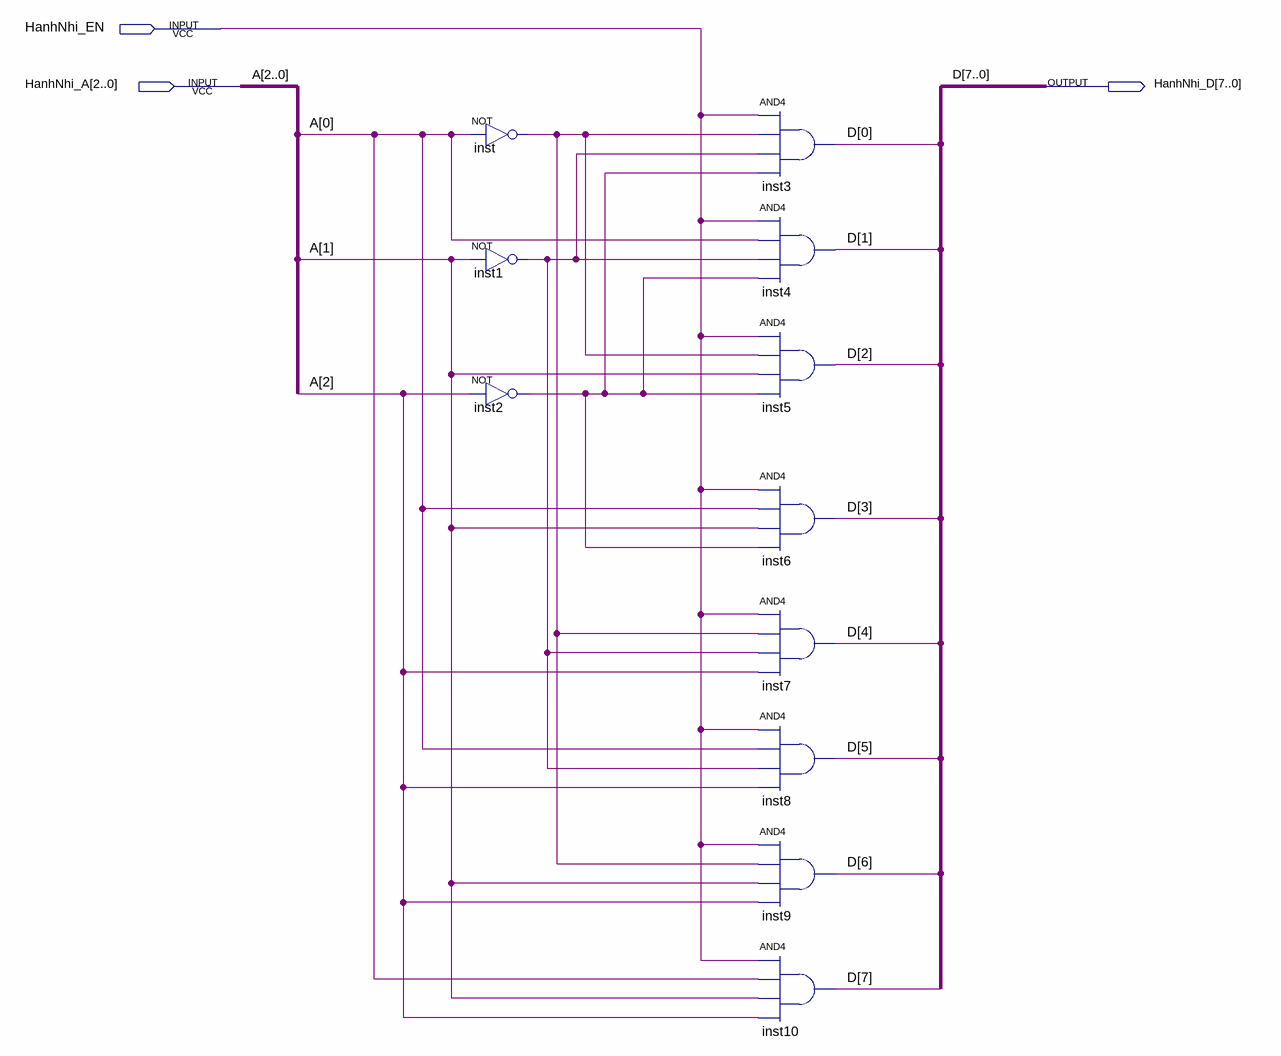
[diagram p0: schematic sheet]
// Quartus schematic Assignment3.bdf as structural Verilog: 11 symbols, 3 pins
module Assignment3 (
  input  HanhNhi_EN,
  input  [2:0] HanhNhi_A,
  output [7:0] HanhNhi_D
);

  wire inst1_out, inst2_out, inst_out;

  not inst (inst_out, HanhNhi_A[0]);
  not inst1 (inst1_out, HanhNhi_A[1]);
  not inst2 (inst2_out, HanhNhi_A[2]);
  and inst3 (HanhNhi_D[0], HanhNhi_EN, inst_out, inst1_out, inst2_out);
  and inst4 (HanhNhi_D[1], HanhNhi_EN, HanhNhi_A[0], inst1_out, inst2_out);
  and inst5 (HanhNhi_D[2], HanhNhi_EN, inst_out, HanhNhi_A[1], inst2_out);
  and inst6 (HanhNhi_D[3], HanhNhi_EN, HanhNhi_A[0], HanhNhi_A[1], inst2_out);
  and inst7 (HanhNhi_D[4], HanhNhi_EN, inst_out, inst1_out, HanhNhi_A[2]);
  and inst8 (HanhNhi_D[5], HanhNhi_EN, HanhNhi_A[0], inst1_out, HanhNhi_A[2]);
  and inst9 (HanhNhi_D[6], HanhNhi_EN, inst_out, HanhNhi_A[1], HanhNhi_A[2]);
  and inst10 (HanhNhi_D[7], HanhNhi_EN, HanhNhi_A[0], HanhNhi_A[1], HanhNhi_A[2]);

  // Other names for the same wires on the sheet: A[2:0] = HanhNhi_A; D[7:0] = HanhNhi_D
endmodule
